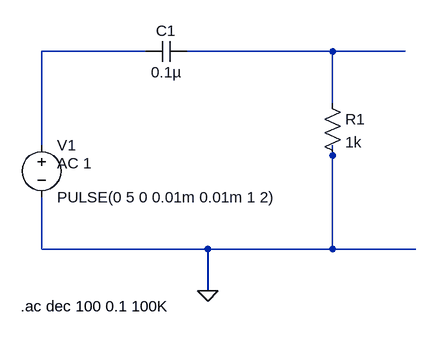
[diagram p0: schematic lowpasshighpass.asc]
lowpasshighpass.asc, the LTspice schematic file:
Version 4
SHEET 1 1160 680
WIRE 720 -496 560 -496
WIRE 1008 -496 784 -496
WIRE 1120 -496 1008 -496
WIRE 1008 -416 1008 -496
WIRE 560 -352 560 -496
WIRE 1008 -336 1008 -352
WIRE 560 -192 560 -272
WIRE 816 -192 560 -192
WIRE 1008 -192 1008 -336
WIRE 1008 -192 816 -192
WIRE 1136 -192 1008 -192
WIRE 816 -128 816 -192
FLAG 816 -128 0
SYMBOL voltage 560 -368 R0
WINDOW 123 24 44 Left 2
WINDOW 39 0 0 Left 0
SYMATTR Value2 AC 1
SYMATTR InstName V1
SYMATTR Value PULSE(0 5 0 0.01m 0.01m 1 2)
SYMBOL res 992 -432 R0
SYMATTR InstName R1
SYMATTR Value 1k
SYMBOL cap 784 -512 R90
WINDOW 0 0 32 VBottom 2
WINDOW 3 32 32 VTop 2
SYMATTR InstName C1
SYMATTR Value 0.1µ
TEXT 528 -104 Left 2 !.ac dec 100 0.1 100K

The netlist it stands for:
* lowpasshighpass.asc
V1 N001 0 PULSE(0 5 0 0.01m 0.01m 1 2) AC 1
R1 N002 0 1k
C1 N002 N001 0.1µ
.ac dec 100 0.1 100K
.backanno
.end